# EAGLE design relay (EAGLE 6.4)
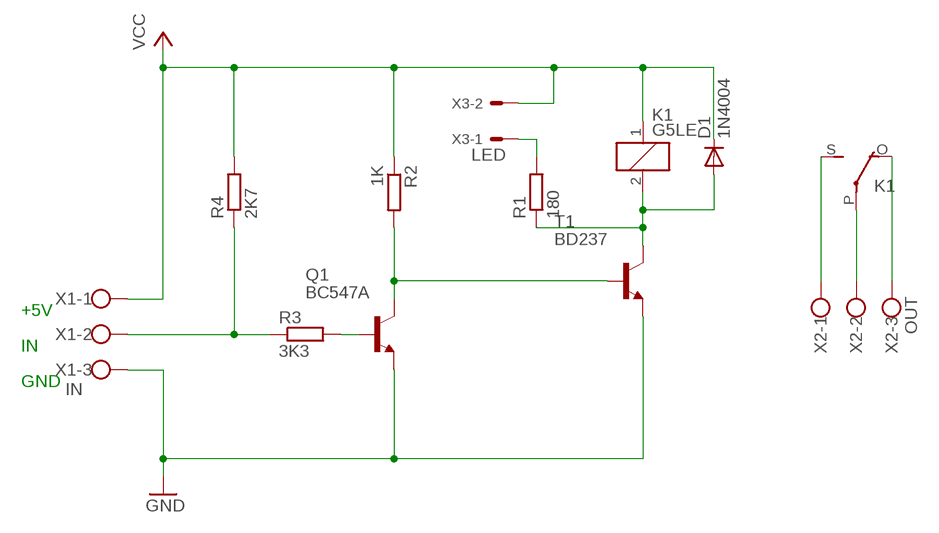
[diagram p0: schematic, sheet 1]

## Parts
D1  1N4004  [DO41-10]
K1  G5LE  [G5LE]
Q1  BC547A  [TO92]
R1  180  R-EU_0207/10  [0207/10]
R2  1K  R-EU_0207/7  [0207/7]
R3  3K3  R-EU_0207/10  [0207/10]
R4  2K7  R-EU_0207/10  [0207/10]
T1  BD237  -NPN-TO126V  [TO126V]
X1  IN  AK550/3  [AK550/3]
X2  OUT  W237-103  [W237-103]
X3  LED  22-27-2021-02  [6410-02]

## Nets
GND: Q1.1(E) T1.1(E) X1.3
N$1: K1.S(2:S) X2.1
N$2: K1.P(2:P) X2.2
N$3: K1.O(2:O) X2.3
N$4: R3.1 R4.1 X1.2
N$5: Q1.3(C) R2.2 T1.3(B)
N$6: R1.2 X3.1
N$7: Q1.2(B) R3.2
N$9: D1.A K1.2 R1.1 T1.2(C)
VCC: D1.C K1.1 R2.1 R4.2 X1.1 X3.2

## Notes on the sheet
- +5V
- IN
- GND

## Library data of the parts
D1 = diode:1N4004: DIODE general purpose rectifier, 1 A
K1 = relay:G5LE: RELAY 1 x switch, 10 A/120 V AC, 8 A/30 V DC, Omron; OC_FARNELL: unknown; OC_NEWARK: unknown
Q1 = transistor-npn:BC547*: NPN Transistor
R1 R3 R4 = rcl:R-EU_: RESISTOR, European symbol
R2 = resistor:R-EU_: RESISTOR, European symbol
T1 = transistor-neu-to92:*-NPN-: NPN Transistror
X1 = con-ptr500+:AK550/3: CONNECTOR
X2 = con-wago-500:W237-103: WAGO SCREW CLAMP; MPN: 237-103; OC_FARNELL: unknown; OC_NEWARK: 18M7116
X3 = con-molex:22-?-02: CONNECTOR wire to board 2.54 mm (.1 inch) pitch header; OC_FARNELL: unknown; OC_NEWARK: unknown

## Board
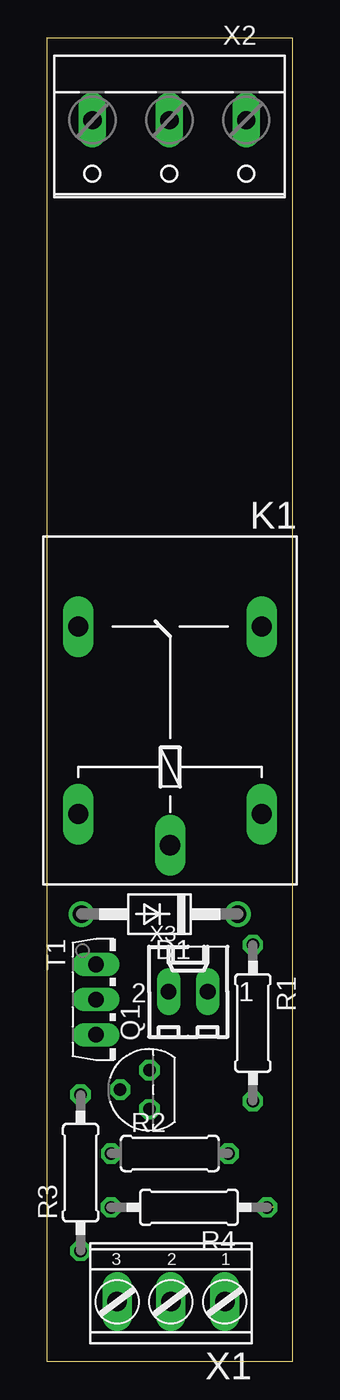
[diagram p1: board, top side]
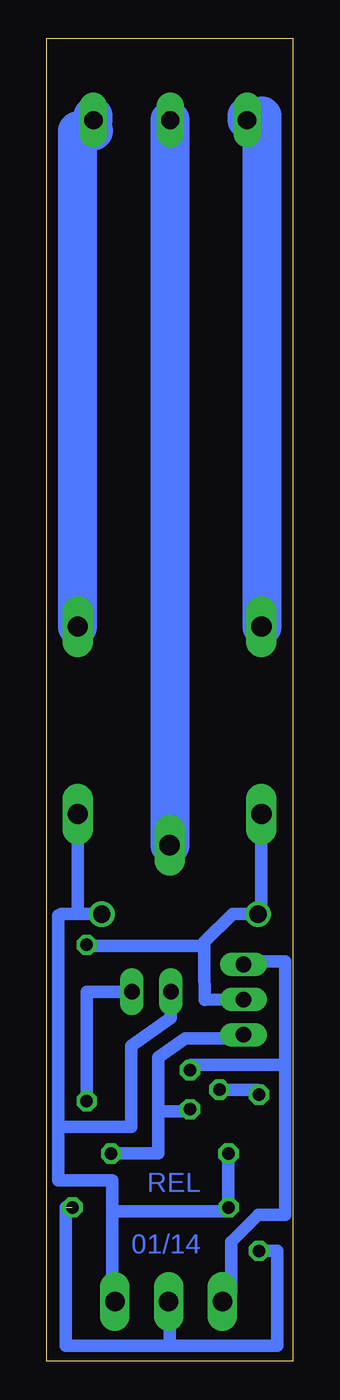
[diagram p2: board, bottom side, seen from below]

Size 15.99 x 86.03 mm. Coordinates in mm from the lower left corner, seen from the top.
Outline: 0,0 15.99,0 15.99,86.03 0,86.03 0,0
Copper layers (1*16): Top 0.035mm / dielectric 1.5mm / Bottom 0.035mm
Design rules "default": minimum track width 10mil, minimum drill 24mil, track to track 8mil, track to pad 8mil, pad to pad 8mil, via to via 8mil, smd to smd 8mil, copper to edge 40mil, drill to drill 8mil, minimum pad ring 10mil, minimum via ring 8mil, stop-mask expansion 4mil, vias tented up to drill 0mil, thermal gap 10mil

### Footprints (pad centres in the part's own frame; a part is rotated, then mirrored left to right if it is on the bottom)
DO41-10 = drill 1.118: A 5.08,0; C -5.08,0
G5LE = drill 1.321 long: 1 -7.493,-5.969; 2 -7.493,5.969; O 4.699,5.969; P -9.525,0; S 4.699,-5.969
TO92 = drill 0.813 octagon: 1 1.27,0; 2 0,1.905; 3 -1.27,0
0207/10 = drill 0.813 octagon: 1 -5.08,0; 2 5.08,0
0207/7 = drill 0.813 octagon: 1 -3.81,0; 2 3.81,0
TO126V = drill 1.016 long: 1 -2.286,-1.27; 2 0,-1.27; 3 2.286,-1.27
AK550/3 = drill 1.27 long: 1 -3.5,0; 2 0,0; 3 3.5,0
W237-103 = drill 1.194 long: 1 -5,-1.29; 2 0,-1.29; 3 5,-1.29
6410-02 = drill 1.016 long: 1 1.27,0; 2 -1.27,0

### Placement (x,y rotation side)
D1  7.34,29.07 180 top
K1  8.02,43.07 90 top
Q1  6.68,17.65 90 top
R1  13.4,21.99 270 top
R2  8,13.5 0 top
R3  2.2,12.25 90 top
R4  9.25,10 180 top
T1  4.48,23.52 270 top
X1  8.08,3.86 180 top
X2  7.97,79.42 180 top
X3  9.2,24.02 0 top

### Tracks (layer width: path | path; a pad name or v marks a point on that pad's centre or on a via)
GND
  Bottom 0.406: Q1.1 6.6,19.25
  Bottom 0.813: X1.3 4,4.44 4,7.75 2.25,9.5 0.5,9.5 0.5,19.25 | 6.6,19.25 0.5,19.25 | 0.5,19.25 0.5,26 2.66,26 T1.1
N$1
  Bottom 0.406: K1.S 14,47.77 | X2.1 13,80.72
  Bottom 2.184: 12.97,80 X2.1
  Bottom 2.54: 14,47.77 14,80 12.97,80 | 13,80.72 13,81
N$2
  Bottom 0.406: K1.P 7.97,33.55
  Bottom 2.54: 7.97,33.55 X2.2
N$3
  Bottom 0.406: K1.O 2,47.77 | 2,81 2.97,81
  Bottom 2.54: 2,47.77 2,81 | 2.97,81 X2.3
N$4  (1 unrouted)
  Bottom 0.406: X1.2 8,3.86
  Bottom 0.813: R3.1 1,7.17 1,1 8,1 | 8,1 14.75,1 14.75,10 | 8,3.86 8,1
N$5
  Bottom 0.406: 6.81,16.25 Q1.3
  Bottom 0.813: T1.3 3.69,21 7,21 8.75,19.75 8.75,16.25 | 8.75,16.25 6.81,16.25 | R2.2 8.75,13.5 8.75,16.25
N$6
  Bottom 0.813: X3.1 13.4,24.02 R1.2
N$7
  Bottom 0.813: R3.2 2.27,17.65 Q1.2
N$9
  Bottom 0.406: R1.1 12.83,27 | 2.05,29.1 D1.A | 6,27 5.75,27.25
  Bottom 0.813: T1.2 5.73,23.48 5.75,25.75 5.75,27.25 3.9,29.1 2.05,29.1 K1.2 | 12.83,27 6,27
VCC
  Bottom 0.406: 11.75,3.86 11.75,4.11 | 4.17,9.75 R4.2 4.19,10 | K1.1 14,35.58
  Bottom 0.813: X1.1 11.75,3.86 | 11.75,4.11 11.75,9.75 | X3.2 7.93,22.32 10.5,20.5 10.5,15.25 15.25,15.25 | 15.25,15.25 15.25,29 15.07,29.07 14,29.07 | D1.C 14,29.07 | 11.75,9.75 11.75,11.75 15.25,11.75 15.25,15.25 | 11.75,9.75 4.17,9.75 | 14,35.58 14,29.07 | 4.19,10 R2.1

### Text on the board
Bottom: REL | 01/14